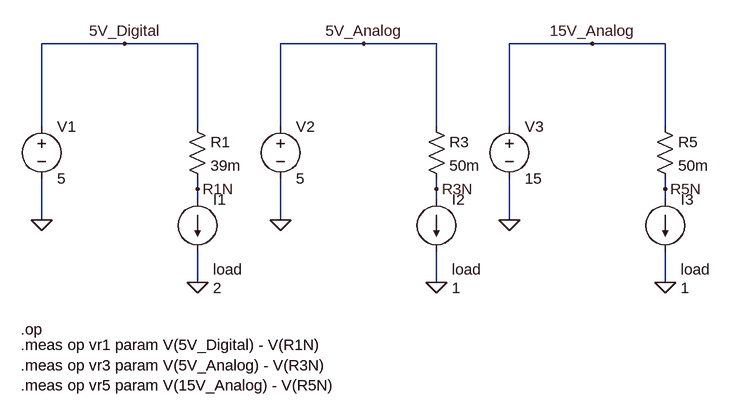
[diagram p0: schematic CurrentShuntSim.asc]
CurrentShuntSim.asc, the LTspice schematic file:
Version 4
SHEET 1 1420 680
WIRE 512 128 384 128
WIRE 624 128 512 128
WIRE 880 128 752 128
WIRE 992 128 880 128
WIRE 1232 128 1104 128
WIRE 1344 128 1232 128
WIRE 384 256 384 128
WIRE 624 256 624 128
WIRE 752 256 752 128
WIRE 992 256 992 128
WIRE 1104 256 1104 128
WIRE 1344 256 1344 128
WIRE 624 352 624 336
WIRE 992 352 992 336
WIRE 1344 352 1344 336
WIRE 624 368 624 352
WIRE 992 368 992 352
WIRE 1344 368 1344 352
WIRE 384 400 384 336
WIRE 752 400 752 336
WIRE 1104 400 1104 336
WIRE 624 496 624 448
WIRE 992 496 992 448
WIRE 1344 496 1344 448
FLAG 384 400 0
FLAG 624 496 0
FLAG 512 128 5V_Digital
FLAG 752 400 0
FLAG 992 496 0
FLAG 880 128 5V_Analog
FLAG 1104 400 0
FLAG 1344 496 0
FLAG 1232 128 15V_Analog
FLAG 624 352 R1N
FLAG 992 352 R3N
FLAG 1344 352 R5N
SYMBOL voltage 384 240 R0
WINDOW 123 0 0 Left 0
WINDOW 39 0 0 Left 0
SYMATTR InstName V1
SYMATTR Value 5
SYMBOL res 608 240 R0
SYMATTR InstName R1
SYMATTR Value 39m
SYMATTR SpiceLine tol=0
SYMBOL voltage 752 240 R0
WINDOW 123 0 0 Left 0
WINDOW 39 0 0 Left 0
SYMATTR InstName V2
SYMATTR Value 5
SYMBOL res 976 240 R0
SYMATTR InstName R3
SYMATTR Value 50m
SYMATTR SpiceLine tol=0
SYMBOL voltage 1104 240 R0
WINDOW 123 0 0 Left 0
WINDOW 39 0 0 Left 0
SYMATTR InstName V3
SYMATTR Value 15
SYMBOL res 1328 240 R0
SYMATTR InstName R5
SYMATTR Value 50m
SYMATTR SpiceLine tol=0
SYMBOL current 624 368 R0
WINDOW 3 24 136 Left 2
WINDOW 123 0 0 Left 0
WINDOW 39 24 108 Left 2
SYMATTR InstName I1
SYMATTR Value 2
SYMATTR SpiceLine load
SYMBOL current 992 368 R0
WINDOW 3 24 136 Left 2
WINDOW 123 0 0 Left 0
WINDOW 39 24 108 Left 2
SYMATTR InstName I2
SYMATTR Value 1
SYMATTR SpiceLine load
SYMBOL current 1344 368 R0
WINDOW 3 24 136 Left 2
WINDOW 123 0 0 Left 0
WINDOW 39 24 108 Left 2
SYMATTR InstName I3
SYMATTR Value 1
SYMATTR SpiceLine load
TEXT 352 568 Left 2 !.op
TEXT 352 592 Left 2 !.meas op vr1 param V(5V_Digital) - V(R1N)\n.meas op vr3 param V(5V_Analog) - V(R3N)\n.meas op vr5 param V(15V_Analog) - V(R5N)

The netlist it stands for:
* CurrentShuntSim.asc
V1 5V_Digital 0 5
R1 5V_Digital R1N 39m tol=0
V2 5V_Analog 0 5
R3 5V_Analog R3N 50m tol=0
V3 15V_Analog 0 15
R5 15V_Analog R5N 50m tol=0
I1 R1N 0 2 load
I2 R3N 0 1 load
I3 R5N 0 1 load
.op
.meas op vr1 param V(5V_Digital) - V(R1N)
.meas op vr3 param V(5V_Analog) - V(R3N)
.meas op vr5 param V(15V_Analog) - V(R5N)
.backanno
.end

* Results of the author's LTspice run, read from the files saved beside the schematic
* Operating Point:
*   V(5v_digital) = 5 V
*   V(r1n) = 4.922 V
*   V(5v_analog) = 5 V
*   V(r3n) = 4.95 V
*   V(15v_analog) = 15 V
*   V(r5n) = 14.95 V
*   I(I1) = 2 A
*   I(I2) = 1 A
*   I(I3) = 1 A
*   I(R1) = 2 A
*   I(R3) = 1 A
*   I(R5) = 1 A
*   I(V1) = -2 A
*   I(V2) = -1 A
*   I(V3) = -1 A